# Altium schematic sheet Connections.SchDoc
size A4; SheetNumber: 3; SheetTotal: 3
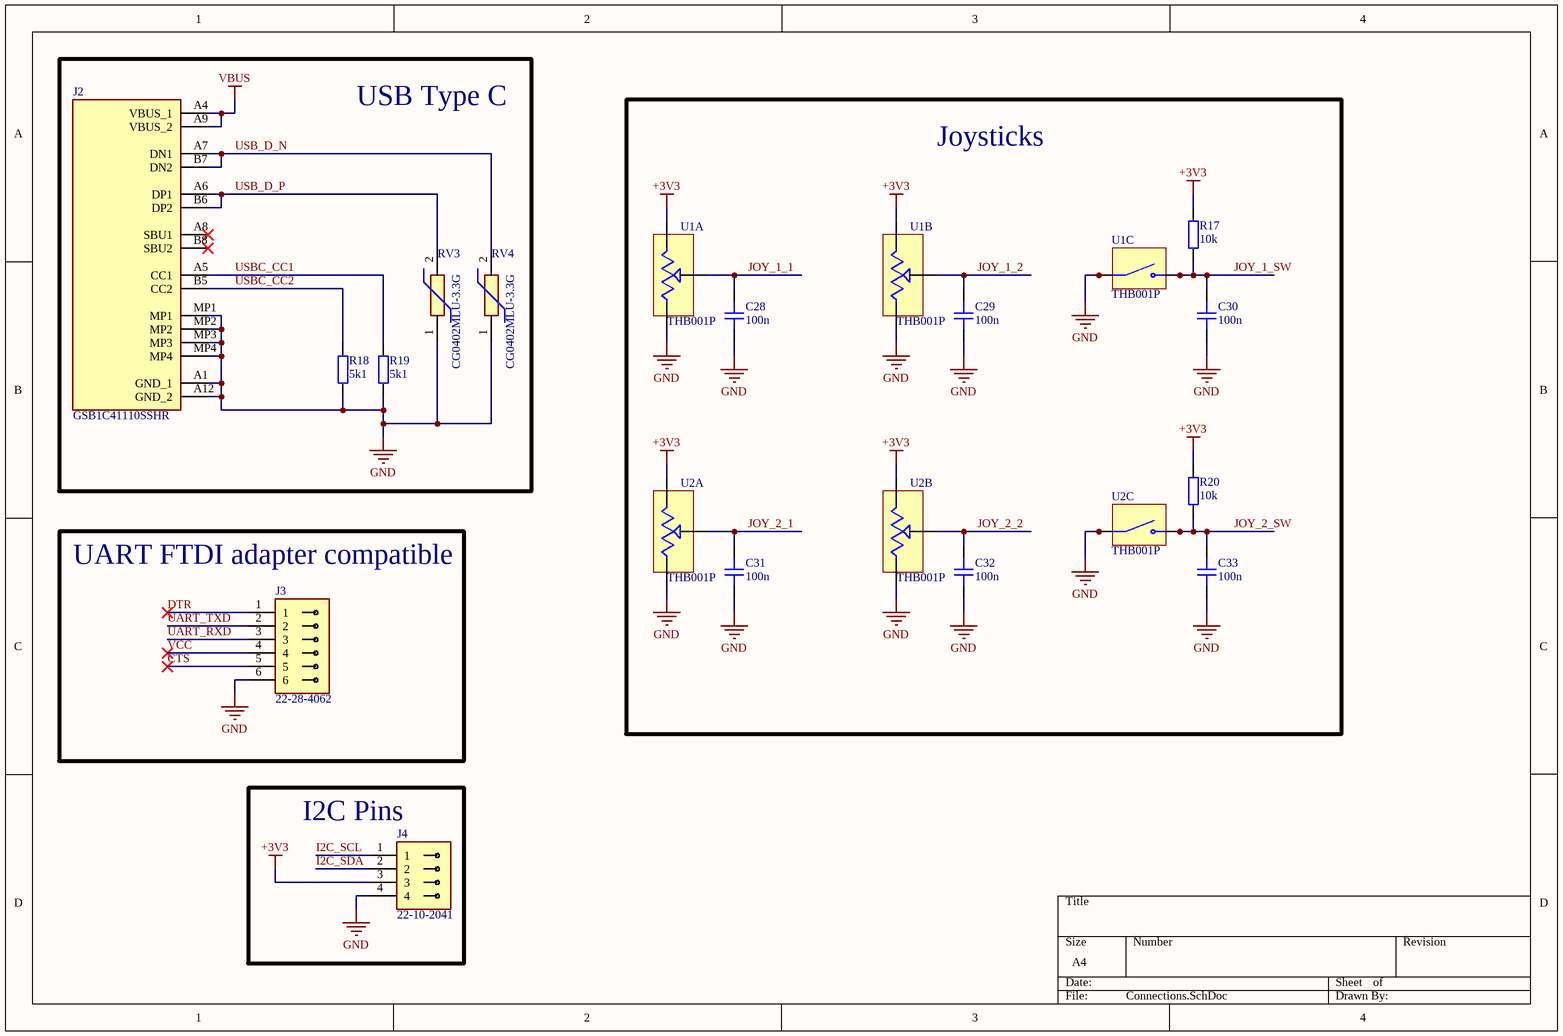
[diagram p0: Connections.SchDoc]

## Parts
C28  100n  [CAP_0402]
C29  100n  [CAP_0402]
C30  100n  [CAP_0402]
C31  100n  [CAP_0402]
C32  100n  [CAP_0402]
C33  100n  [CAP_0402]
J2  GSB1C41110SSHR  [GSB1C41110SSHR]
J3  22-28-4062  [HDRV6W66P0X254_1X6_1524X249X838P]
J4  22-10-2041  [HDRV4W67P0X254_1X4_991X236X1117P]
R17  10k  [RES_0402]
R18  5k1  [RES_0402]
R19  5k1  [RES_0402]
R20  10k  [RES_0402]
RV3  CG0402MLU-3.3G  [VARC1005X41N]
RV4  CG0402MLU-3.3G  [VARC1005X41N]
U1  THB001P  [CNK_THB001P]  (parts A,B,C of 3)
U2  THB001P  [CNK_THB001P]  (parts A,B,C of 3)

## Blocks framed on the sheet
USB Type C: J2 R18 R19 RV3 RV4
Joysticks: C28-C33 R17 R20 U1 U2
UART FTDI adapter compatible: J3
I2C Pins: J4

## Nets
+3V3: J4.3 R17.1 R20.1 U1.VR1_1 U1.VR2_1 U2.VR1_1 U2.VR2_1
GND: C28.2 C29.2 C30.2 C31.2 C32.2 C33.2 J2.A1(GND_1) J2.A12(GND_2) J2.MP1 J2.MP2 J2.MP3 J2.MP4 J3.6 J4.4 R18.1 R19.1 RV3.1 RV4.1 U1.C(COM) U1.D(COM) U1.VR1_3 U1.VR2_3 U2.C(COM) U2.D(COM) U2.VR1_3 U2.VR2_3
VBUS: J2.A4(VBUS_1) J2.A9(VBUS_2)
CTS: J3.5
DTR: J3.1
I2C_SCL: J4.1
I2C_SDA: J4.2
JOY_1_1: C28.1 U1.VR1_2
JOY_1_2: C29.1 U1.VR2_2
JOY_1_SW: C30.1 R17.2 U1.A(NO) U1.B(NO)
JOY_2_1: C31.1 U2.VR1_2
JOY_2_2: C32.1 U2.VR2_2
JOY_2_SW: C33.1 R20.2 U2.A(NO) U2.B(NO)
UART_RXD: J3.3
UART_TXD: J3.2
USB_D_N: J2.A7(DN1) J2.B7(DN2) RV4.2
USB_D_P: J2.A6(DP1) J2.B6(DP2) RV3.2
USBC_CC1: J2.A5(CC1) R19.2
USBC_CC2: J2.B5(CC2) R18.2
VCC: J3.4

Not connected (* = marked no-connect by the designer): J2 A8(SBU1)* B8(SBU2)*

## Library data of the parts
C28-C33 = CAP_0402: Capacitor SMD 0402; Manufacturer: *; Manufacturer Part Number: *; Distributor Link: *; LCSC: *; Rating: *; Dielectric: *
J2 = GSB1C41110SSHR: Connector; Manufacturer_Name: Amphenol Communications Solutions; Datasheet Link: https://cdn.amphenol-cs.com/media/wysiwyg/files/drawing/gsb1c41x10sshr-ax1.pdf; Height: 3.41mm; Manufacturer_Part_Number: GSB1C41110SSHR
J3 = 22-28-4062: Connector; Manufacturer_Name: Molex; Datasheet Link: https://datasheet.datasheetarchive.com/originals/distributors/SFDatasheet-1/sf-00031037.pdf; Height: 8.38mm; Manufacturer_Part_Number: 22-28-4062; Mouser Part Number: 538-22-28-4062; Mouser Price/Stock: https://www.mouser.com/Search/Refine.aspx?Keyword=538-22-28-4062
J4 = 22-10-2041: Connector; Manufacturer_Name: Molex; Datasheet Link: https://www.molex.com/en-us/products/part-detail/22102041?display=pdf; Height: 11.17mm; Manufacturer_Part_Number: 22-10-2041; Mouser Part Number: 538-22-10-2041; Mouser Price/Stock: https://www.mouser.co.uk/ProductDetail/Molex/22-10-2041?qs=I2tGkhXPHwPlInpHG6ZNmQ%3D%3D
R17-R20 = RES_0402: Resistor SMD 0402; Manufacturer: *; Manufacturer Part Number: *; Distributor Link: *; LCSC: *
RV3 RV4 = CG0402MLU-3.3G: ESD Diode; Manufacturer_Name: Bourns; Datasheet Link: https://www.bourns.com/docs/Product-Datasheets/MLU.pdf; Height: 0.41mm; Manufacturer_Part_Number: CG0402MLU-3.3G; Mouser Part Number: 652-CG0402MLU-3.3G; Mouser Price/Stock: https://www.mouser.co.uk/ProductDetail/Bourns/CG0402MLU-3.3G?qs=m8myXnDJXpWVM8EQWErxtQ%3D%3D; Arrow Part Number: CG0402MLU-3.3G; Arrow Price/Stock: https://www.arrow.com/en/products/cg0402mlu-3.3g/bourns?utm_currency=USD&region=nac
U1 U2 = THB001P: Joystick, 2 - Axis Analog (Resistive) Output; MF: C&K; Price: None; Availability: In Stock; MP: THB001P; Package: None; SnapEDA_Link: https://www.snapeda.com/parts/THB001P/C%2526K/view-part/?ref=snap; Check_prices: https://www.snapeda.com/parts/THB001P/C%2526K/view-part/?ref=eda; Value: *; Purchase-URL: https://pricing.snapeda.com/search/part/THB001P/?ref=eda